# Altium schematic sheet vs1003.SchDoc
size A4
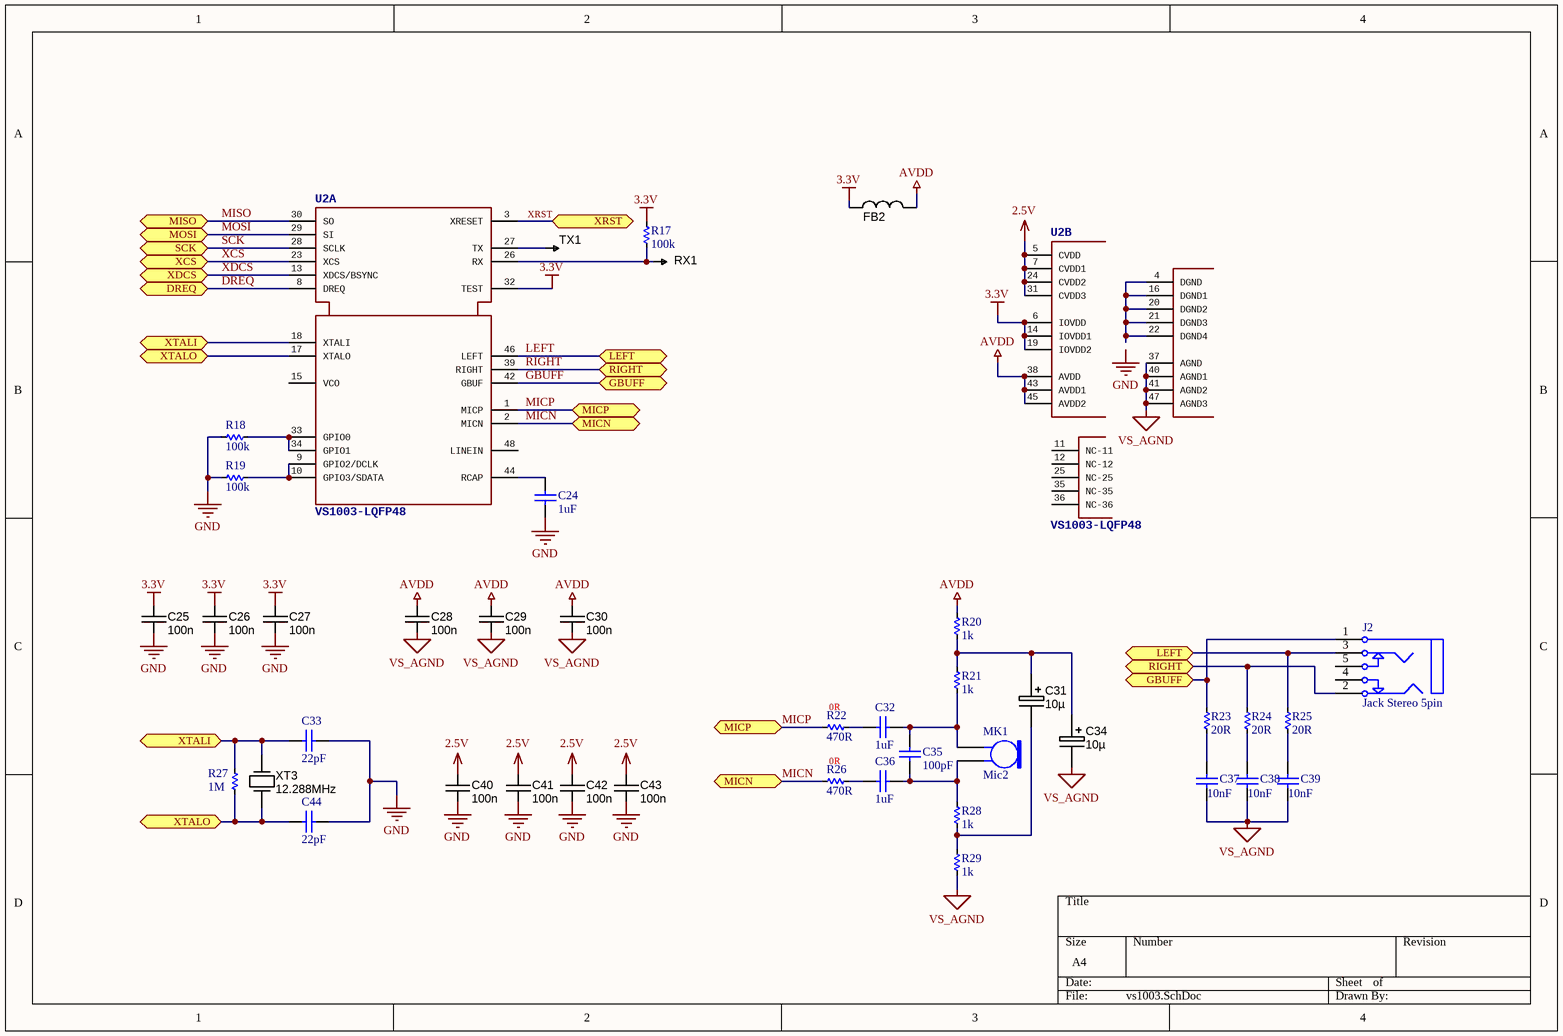
[diagram p0: vs1003.SchDoc]

## Parts
C24  value 1uF  [C0805]  (hidden comment: Cap Semi)
C25  value 100n  [CAPC1608X90N]  (hidden comment: approved sub OK)
C26  value 100n  [CAPC1608X90N]  (hidden comment: approved sub OK)
C27  value 100n  [CAPC1608X90N]  (hidden comment: approved sub OK)
C28  value 100n  [CAPC1608X90N]  (hidden comment: approved sub OK)
C29  value 100n  [CAPC1608X90N]  (hidden comment: approved sub OK)
C30  value 100n  [CAPC1608X90N]  (hidden comment: approved sub OK)
C31  10µ  [CAPMP3216X180N]
C32  value 1uF  [C0805]  (hidden comment: Cap Semi)
C33  value 22pF  [C0805]  (hidden comment: Cap Semi)
C34  10µ  [CAPMP3216X180N]
C35  value 100pF  [C0805]  (hidden comment: Cap Semi)
C36  value 1uF  [C0805]  (hidden comment: Cap Semi)
C37  value 10nF  [C0805]  (hidden comment: Cap Semi)
C38  value 10nF  [C0805]  (hidden comment: Cap Semi)
C39  value 10nF  [C0805]  (hidden comment: Cap Semi)
C40  value 100n  [CAPC1608X90N]  (hidden comment: approved sub OK)
C41  value 100n  [CAPC1608X90N]  (hidden comment: approved sub OK)
C42  value 100n  [CAPC1608X90N]  (hidden comment: approved sub OK)
C43  value 100n  [CAPC1608X90N]  (hidden comment: approved sub OK)
C44  value 22pF  [C0805]  (hidden comment: Cap Semi)
FB2  2K2 @ 100 MHz  [FBC2012N]  (value not drawn)
J2  Jack Stereo 5pin  [Audio Jack 5 pin]
MK1  Mic2  [PIN2]
R17  value 100k  [RES-SMD-0805]  (hidden comment: Res)
R18  value 100k  [RES-SMD-0603]  (hidden comment: Res)
R19  value 100k  [RES-SMD-0603]  (hidden comment: Res)
R20  value 1k  [RES-SMD-0603]  (hidden comment: Res)
R21  value 1k  [RES-SMD-0603]  (hidden comment: Res)
R22  value 470R  [RES-SMD-0603]  (hidden comment: Res)
R23  value 20R  [RES-SMD-0805]  (hidden comment: Res)
R24  value 20R  [RES-SMD-0805]  (hidden comment: Res)
R25  value 20R  [RES-SMD-0805]  (hidden comment: Res)
R26  value 470R  [RES-SMD-0603]  (hidden comment: Res)
R27  value 1M  [RES-SMD-0805]  (hidden comment: Res)
R28  value 1k  [RES-SMD-0603]  (hidden comment: Res)
R29  value 1k  [RES-SMD-0603]  (hidden comment: Res)
RX1  TESTPOINT  [TP-R60]  (value not drawn)  (no BOM)
TX1  TESTPOINT  [TP-R60]  (value not drawn)  (no BOM)
U2  VS1003-LQFP48  [LQFP48]  (parts A,B of 2)
XT3  12.288MHz  [CRYSTAL_HC49-US-SM]

## Ports
DREQ, GBUFF, LEFT, MICN, MICP, MISO, MOSI, RIGHT, SCK, XCS, XDCS, XRST, XTALI, XTALO

## Nets
2.5V: C40.1 C41.1 C42.1 C43.1 U2.5(CVDD) U2.7(CVDD1) U2.24(CVDD2) U2.31(CVDD3)
3.3V: C25.1 C26.1 C27.1 FB2.1 R17.1 U2.6(IOVDD) U2.14(IOVDD1) U2.19(IOVDD2) U2.32(TEST)
AVDD: C28.1 C29.1 C30.1 FB2.2 R20.1 U2.38(AVDD) U2.43(AVDD1) U2.45(AVDD2)
GND: C24.1 C25.2 C26.2 C27.2 C33.1 C40.2 C41.2 C42.2 C43.2 C44.1 R18.1 R19.1
VS_AGND: C28.2 C29.2 C30.2 C34.2 C37.1 C38.1 C39.1 R29.2 U2.37(AGND) U2.40(AGND1) U2.41(AGND2) U2.47(AGND3)
DREQ: U2.8(DREQ) ; port DREQ
GBUFF: J2.1 R23.1 U2.42(GBUF) ; port GBUFF
LEFT: J2.3 R25.1 U2.46(LEFT) ; port LEFT
MICN: R26.2 U2.2(MICN) ; port MICN
MICP: R22.2 U2.1(MICP) ; port MICP
MISO: U2.30(SO) ; port MISO
MOSI: U2.29(SI) ; port MOSI
RIGHT: J2.2 R24.1 U2.39(RIGHT) ; port RIGHT
SCK: U2.28(SCLK) ; port SCK
XCS: U2.23(XCS) ; port XCS
XDCS: U2.13(XDCS/BSYNC) ; port XDCS
XRST: U2.3(XRESET) ; port XRST
XTALI: C33.2 R27.1 U2.18(XTALI) XT3.2(OUT) ; port XTALI
XTALO: C44.2 R27.2 U2.17(XTALO) XT3.1(IN) ; port XTALO
NetC24_2: C24.2 U2.44(RCAP)
NetC31_1: C31.1 C34.1 R20.2 R21.1
NetC31_2: C31.2 R28.2 R29.1
NetC32_1: C32.1 R22.1
NetC32_2: C32.2 C35.2 MK1.1 R21.2
NetC35_1: C35.1 C36.2 MK1.2 R28.1
NetC36_1: C36.1 R26.1
NetC37_2: C37.2 R23.2
NetC38_2: C38.2 R24.2
NetC39_2: C39.2 R25.2
NetR17_2: R17.2 RX1.1 U2.26(RX)
NetR18_2: R18.2 U2.33(GPIO0) U2.34(GPIO1)
NetR19_2: R19.2 U2.9(GPIO2/DCLK) U2.10(GPIO3/SDATA)
NetTX1_1: TX1.1 U2.27(TX)
NetU2_4: U2.4(DGND) U2.16(DGND1) U2.20(DGND2) U2.21(DGND3) U2.22(DGND4)

Not connected (* = marked no-connect by the designer): J2 4 5; U2 11(NC-11) 12(NC-12) 15(VCO) 25(NC-25) 35(NC-35) 36(NC-36) 48(LINEIN)

## Notes on the sheet
- (near R22) 0R
- (near R26) 0R
- Labels drawn without touching a wire or pin: GND

## Library data of the parts
C24 C32 C33 C35-C39 C44 = Cap Semi: Capacitor (Semiconductor SIM Model); Published: 8-Jun-2000; LatestRevisionDate: 29-May-2009; LatestRevisionNote: IPC-7351 Footprint Added.; PackageReference: C1206; Publisher: Altium Limited; PackageDescription: Chip Capacitor
C25-C30 C40-C43 = CAPC_100n_0603_X7R_50V_10%: Capacitor SMD Cer 100nF 10% 50V X7R 0603; Manufacturer 1: AVX Corporation; Manufacturer Part Number 1: 06035C104KAT2A; Ratings: 50V; X7R; Material: ceramic; SCDType: spec; Manufacturer 2: TDK Corporation; Manufacturer Part Number 2: C1608X7R1H104K; Package / Case: 0603 (1608 Metric); Tolerance: ±10%; Supplier 1: Digi-Key; Supplier Part Number 1: 478-5052-1-ND; ComponentLink1URL: http://www.avx.com/docs/Catalogs/cx7r.pdf; ComponentLink1Description: http://www.avx.com/docs/Catalogs/cx7r.pdf; Supplier 2: Digi-Key; Supplier Part Number 2: 445-1314-1-ND; ComponentLink2URL: http://product.tdk.com/capacitor/mlcc/en/documents/mlcc_commercial_general_en.pdf; ComponentLink2Description: http://product.tdk.com/capacitor/mlcc/en/documents/mlcc_commercial_general_en.pdf
C31 C34 = CAPT_68u_3216_6V3: Capacitor SMD Tantalum 68uF 10% 6.3V EIA 3216-18; Manufacturer 1: Kemet; Manufacturer Part Number 1: T491A686K006AT; Manufacturer Size Code: A; Material: Solid Tantalum; ESR (Equivalent Series Resistance): 4.000 Ohm; SCDType: spec; Package / Case: 1206 (3216 Metric); Ratings: 6.3V; Tolerance: ±10%; Supplier 1: Digi-Key; Supplier Part Number 1: 399-4698-1-ND; Operating Temperature: -55°C ~ 125°C; Size / Dimension: 0.126" L x 0.063" W (3.20mm x 1.60mm); Height - Seated (Max): 0.071" (1.80mm); ComponentLink1URL: http://www.kemet.com/datasheets&T491A686K006AT; ComponentLink1Description: http://www.kemet.com/datasheets&T491A686K006AT; Value: 10µ
FB2 = FERRITE_2K2-100MHz_0805: Ferrite bead 2.2K Ohm at 100 MHz 200mA 0805 SMD; Manufacturer 1: Laird-Signal Integrity Products; Manufacturer Part Number 1: HZ0805B222R-10; Ratings: 200 mA; 800 mOhm DC; Impedance @ Frequency: 600 Ohm @ 100MHz; DC Resistance (DCR): 800 mOhm Max; Filter Type: Differential Mode - Single; SCDType: source; Size / Dimension: 0.063" L x 0.031" W (1.60mm x 0.80mm); Current Rating: 200mA; Package / Case: 0805 (2012 Metric); Height (Max): 0.043" (1.09mm); ComponentLink1URL: http://www.lairdtech.com/WorkArea/linkit.aspx?LinkIdentifier=id&ItemID=4879; ComponentLink1Description: http://www.lairdtech.com/WorkArea/linkit.aspx?LinkIdentifier=id&ItemID=4879; Supplier 1: Digi-Key; Supplier Part Number 1: 240-2562-1-ND; Mounting Type: Surface Mount; Value: 2K2 @ 100 MHz
J2 = Jack Stereo 5pin: 3-Conductor Jack with 2 break contacts (normals) and 2 auxiliary make contacts; Published: 5-Jan-2004; LatestRevisionDate: 17-Dec-2003; LatestRevisionNote: PCB Footprint replaced.; DatasheetDocument: 07-Mar-2000; Publisher: Altium Limited; ComponentLink1Description: Manufacturer Link; ComponentLink1URL: http://domino.kycon.com/internet/Products.html
MK1 = Mic2: Microphone; Published: 24-Mar-1999; LatestRevisionDate: 17-Jul-2002; LatestRevisionNote: Re-released for DXP Platform.; PackageReference: PIN2; Publisher: Altium Limited
R17-R29 = Res-SMD: Resistor; Manufacturer: Generic Components; Class: Passive; Published: 08/06/2000; Publisher: Altium Hobart Technology Centre
RX1 TX1 = TESTPOINT: SMD test pin
U2 = VS1003-LQFP48: MP3/WMA Audio Codec   http://www.vlsi.fi/fileadmin/datasheets/vlsi/vs1003.pdf
XT3 = Crystal_6MHz_HC49/US: Resonator Ceramic 6.00 MHz 30ppm; Manufacturer 1: CTS-Frequency Controls; Manufacturer Part Number 1: ATS060BSM-1; Frequency: 6MHz; Frequency Stability: ±50ppm; Load Capacitance: 18pF; Operating Mode: Fundamental; Parameter Name: 0.169" (4.30mm); SCDType: spec; Package / Case: HC49/US-SM; Ratings: 6.00 MHz; Supplier 1: Digi-Key; Supplier Part Number 1: CTX882CT-ND; Type: MHz Crystal; Frequency Tolerance: ±30ppm; Operating Temperature: -20°C ~ 70°C; Mounting Type: Surface Mount; Size / Dimension: 0.437" L x 0.190" W (11.10mm x 4.83mm); ComponentLink1URL: http://www.ctscorp.com/components/Datasheets/008-0309-0.pdf; ComponentLink1Description: http://www.ctscorp.com/components/Datasheets/008-0309-0.pdf